# EAGLE schematic doorbell (EAGLE 6.1)
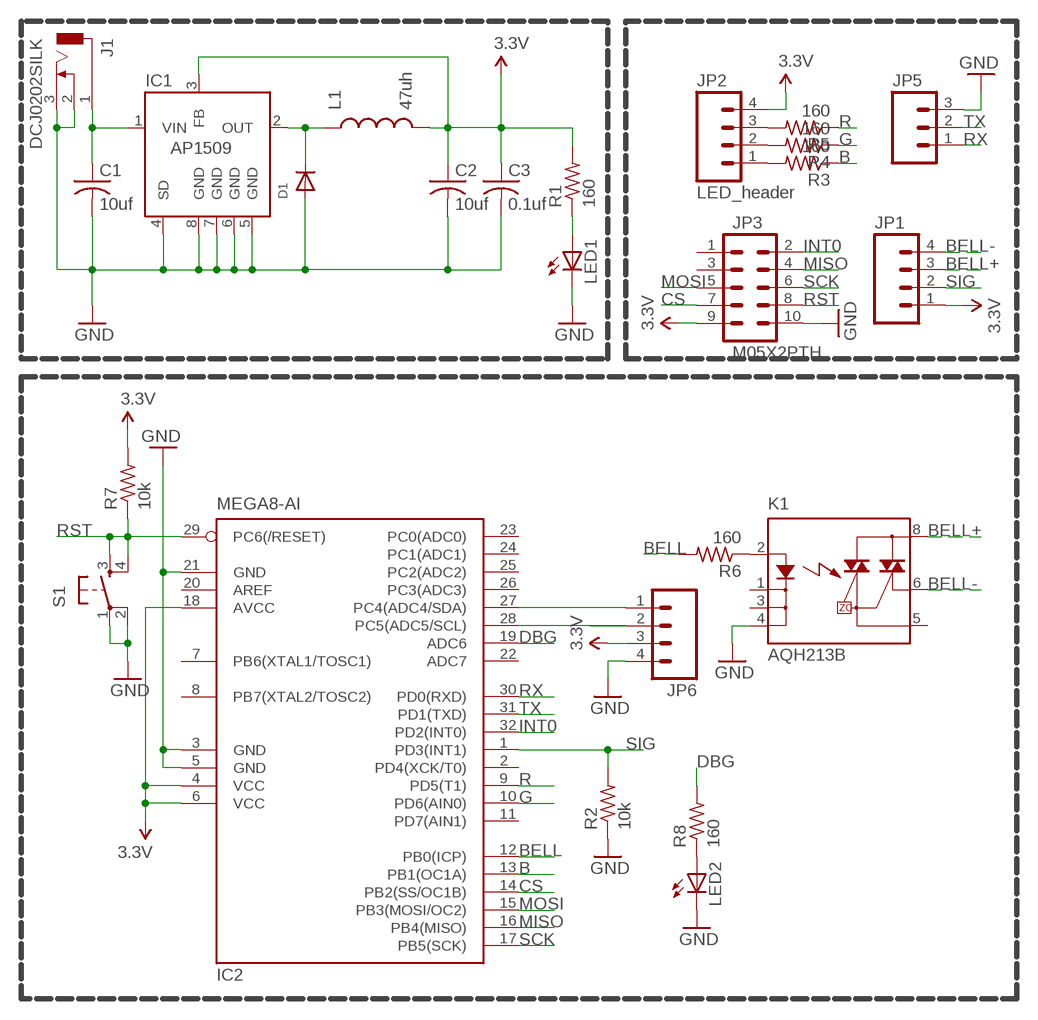
[diagram p0: schematic, sheet 1]

## Parts
C1  10uf  C-USC1206  [C1206]
C2  10uf  C-USC1206  [C1206]
C3  0.1uf  C-USC1206  [C1206]
D1  DIODESOD-123  [SOD-123]
IC1  AP1509  [SOP-8]
IC2  MEGA8-AI  [TQFP32-08]
J1  DCJ0202SILK  [DCJ0202_SILK]
JP1  M04SCREW_SILK  [SCREWTERMINAL-3.5MM-4_SILK]
JP2  LED_header  M04PTH  [1X04]
JP3  M05X2PTH  [AVR_ICSP]
JP5  M03PTH  [1X03]
JP6  M04PTH  [1X04]
K1  AQH213B  [DIL08SMD]
L1  47uh  INDUCTOR1210  [1210]
LED1  LEDSMT1206  [1206]
LED2  LEDSMT1206  [1206]
R1  160  R-US_R1206  [R1206]
R2  10k  R-US_R1206  [R1206]
R3  160  R-US_R1206  [R1206]
R4  160  R-US_R1206  [R1206]
R5  160  R-US_R1206  [R1206]
R6  160  R-US_R1206  [R1206]
R7  10k  R-US_R1206  [R1206]
R8  160  R-US_R1206  [R1206]
S1  TAC_SWITCHSMD  [TACTILE_SWITCH_SMD]

## Nets
3.3V: C2.1 C3.1 IC1.3(FB) IC2.4(VCC) IC2.6(VCC) IC2.18(AVCC) JP1.1 JP2.4 JP3.9 JP6.3 L1.2 R1.2 R7.2
B: IC2.13(PB1(OC1A)) R3.1
BELL: IC2.12(PB0(ICP)) R6.2
BELL+: JP1.3 K1.8(DS1)
BELL-: JP1.4 K1.6(DS3)
CS: IC2.14(PB2(SS/OC1B)) JP3.7
DBG: IC2.19(ADC6) R8.2
G: IC2.10(PD6(AIN0)) R4.1
GND: C1.2 C2.2 C3.2 D1.A IC1.4(SD) IC1.5(GND) IC1.6(GND) IC1.7(GND) IC1.8(GND) IC2.3(GND) IC2.5(GND) IC2.21(GND) J1.2 J1.3 JP3.10 JP5.3 JP6.4 K1.4(K2) LED1.C LED2.C R2.1 S1.1 S1.2
INT0: IC2.32(PD2(INT0)) JP3.2
MISO: IC2.16(PB4(MISO)) JP3.4
MOSI: IC2.15(PB3(MOSI/OC2)) JP3.5
N$1: K1.2(A) R6.1
N$2: C1.1 IC1.1(VIN) J1.1
N$3: D1.C IC1.2(OUT) L1.1
N$7: IC2.27(PC4(ADC4/SDA)) JP6.1
N$8: IC2.28(PC5(ADC5/SCL)) JP6.2
N$10: LED1.A R1.1
N$12: LED2.A R8.1
N$14: JP2.3 R5.2
N$15: JP2.2 R4.2
N$16: JP2.1 R3.2
R: IC2.9(PD5(T1)) R5.1
RST: IC2.29(PC6(/RESET)) JP3.8 R7.1 S1.3 S1.4
RX: IC2.30(PD0(RXD)) JP5.1
SCK: IC2.17(PB5(SCK)) JP3.6
SIG: IC2.1(PD3(INT1)) JP1.2 R2.2
TX: IC2.31(PD1(TXD)) JP5.2
Unconnected: IC2.2(PD4(XCK/T0)) IC2.7(PB6(XTAL1/TOSC1)) IC2.8(PB7(XTAL2/TOSC2)) IC2.11(PD7(AIN1)) IC2.20(AREF) IC2.22(ADC7) IC2.23(PC0(ADC0)) IC2.24(PC1(ADC1)) IC2.25(PC2(ADC2)) IC2.26(PC3(ADC3)) JP3.1 JP3.3 K1.1(K) K1.3(K1) K1.5(DS2)

## Library data of the parts
C1-C3 = adafruit:C-US: CAPACITOR, American symbol
D1 = adafruit:DIODE: Diode SMADIODE - SMA Surface Mount Package 20V 1A Schottky Diode Digikey: 641-1014-6-ND DO-1N4148 - Through Hole Small Current Diode SOD-123 20V 1 A (.5mV Vf) Schottky Diode - Digikey: MBRX120TPMSCT-ND SOD-323 10V 570mA (.38mV Vf, 3ns) Schottky Diode - Digikey: ZLLS410CT-ND SOD-523 30V 30mA Schottky Diode (RB751S-40TE61) - Digikey: RB751S-40TE61CT-ND SOT23-R/W - SOT23 Package (R = Solder Paste/Reflow Ovens, W = Hand-Soldering) BAT54Film 40V 300mA - Digikey: 497-7162-1-ND
IC1 = diodes-inc:AP1509: 150KHz, 2A PWM BUCK DC/DC CONVERTER
IC2 = atmel:MEGA8: MICROCONTROLLER 8 Kbytes FLASH, 1 kbytes SRAM, 512 bytes EEPROM, USART, 6-channel 10 bit ADC, 2-channel 8 bit ADC Pin compatible with Atmega48, ATMega88, ATMega168 Source: avr.lbr; MPN: ATMEGA8-16AU; OC_FARNELL: 9171371; OC_NEWARK: 73M8863
J1 = con-jack:DCJ0202: DC POWER JACK Source: DCJ0202.pdf
JP1 JP2 JP6 = sparkfun:M04: Header 4 Standard 4-pin 0.1" header. Use with straight break away headers (SKU : PRT-00116), right angle break away headers (PRT-00553), swiss pins (PRT-00743), machine pins (PRT-00117), and female headers (PRT-00115). Molex polarized connector foot print use with SKU : PRT-08231 with associated crimp pins and housings. 1MM SMD Version SKU: PRT-10208
JP3 = sparkfun:M05X2: Header 5x2 Standard 10-pin dual row 0.1" header. Commonly used with AVR-ISP. Use with Spark Fun Electronics SKU: PRT-00778
JP5 = sparkfun:M03: Header 3 Standard 3-pin 0.1" header. Use with straight break away headers (SKU : PRT-00116), right angle break away headers (PRT-00553), swiss pins (PRT-00743), machine pins (PRT-00117), and female headers (PRT-00115). Molex polarized connector foot print use with SKU : PRT-08232 with associated crimp pins and housings.
K1 = relay:AQH*213: SOLID STATE RELAY NAiS Source: http://www.mew-europe.com/.. en_ds_61613_0000.pdf
L1 = sparkfun:INDUCTOR: Inductors Basic Inductor/Choke - 0603 and 1206. Footprints are not proven and vary greatly between part numbers.
LED1 LED2 = led:LED: LED OSRAM: - CHIPLED LG R971, LG N971, LY N971, LG Q971, LY Q971, LO R971, LY R971 LH N974, LH R974 LS Q976, LO Q976, LY Q976 LO Q996 - Hyper CHIPLED LW Q18S LB Q993, LB Q99A, LB R99A - SideLED LS A670, LO A670, LY A670, LG A670, LP A670 LB A673, LV A673, LT A673, LW A673 LH A674 LY A675 LS A676, LA A676, LO A676, LY A676, LW A676 LS A679, LY A679, LG A679 - Hyper Micro SIDELED® LS Y876, LA Y876, LO Y876, LY Y876 LT Y87S - SmartLED LW L88C, LW L88S LB L89C, LB L89S, LG L890 LS L89K, LO L89K, LY L89K LS L896, LA L896, LO L896, LY L896 - TOPLED LS T670, LO T670, LY T670, LG T670, LP T670 LSG T670, LSP T670, LSY T670, LOP T670, LYG T670 LG T671, LOG T671, LSG T671 LB T673, LV T673, LT T673, LW T673 LH T674 LS T676, LA T676, LO T676, LY T676, LB T676, LH T676, LSB T676, LW T676 LB T67C, LV T67C, LT T67C, LS T67K, LO T67K, LY T67K, LW E67C LS E67B, LA E67B, LO E67B, LY E67B, LB E67C, LV E67C, LT E67C LW T67C LS T679, LY T679, LG T679 LS T770, LO T770, LY T770, LG T770, LP T770 LB T773, LV T773, LT T773, LW T773 LH T774 LS E675, LA E675, LY E675, LS T675 LS T776, LA T776, LO T776, LY T776, LB T776 LHGB T686 LT T68C, LB T68C - Hyper Mini TOPLED® LB M676 - Mini TOPLED Santana® LG M470 LS M47K, LO M47K, LY M47K Source: http://www.osram.convergy.de LUXEON: - LUMILED® LXK2-PW12-R00, LXK2-PW12-S00, LXK2-PW14-U00, LXK2-PW14-V00 LXK2-PM12-R00, LXK2-PM12-S00, LXK2-PM14-U00 LXK2-PE12-Q00, LXK2-PE12-R00, LXK2-PE12-S00, LXK2-PE14-T00, LXK2-PE14-U00 LXK2-PB12-K00, LXK2-PB12-L00, LXK2-PB12-M00, LXK2-PB14-N00, LXK2-PB14-P00, LXK2-PB14-Q00 LXK2-PR12-L00, LXK2-PR12-M00, LXK2-PR14-Q00, LXK2-PR14-R00 LXK2-PD12-Q00, LXK2-PD12-R00, LXK2-PD12-S00 LXK2-PH12-R00, LXK2-PH12-S00 LXK2-PL12-P00, LXK2-PL12-Q00, LXK2-PL12-R00 Source: www.luxeon.com KINGBRIGHT: KA-3528ASYC Source: www.kingbright.com
R1-R8 = adafruit:R-US_: RESISTOR, American symbol
S1 = sparkfun:TAC_SWITCH: Momentary Switch Button commonly used for reset or general input. Spark Fun Electronics SKU : COM-00097